# Altium schematic sheet Header_Conn.SchDoc
size A4
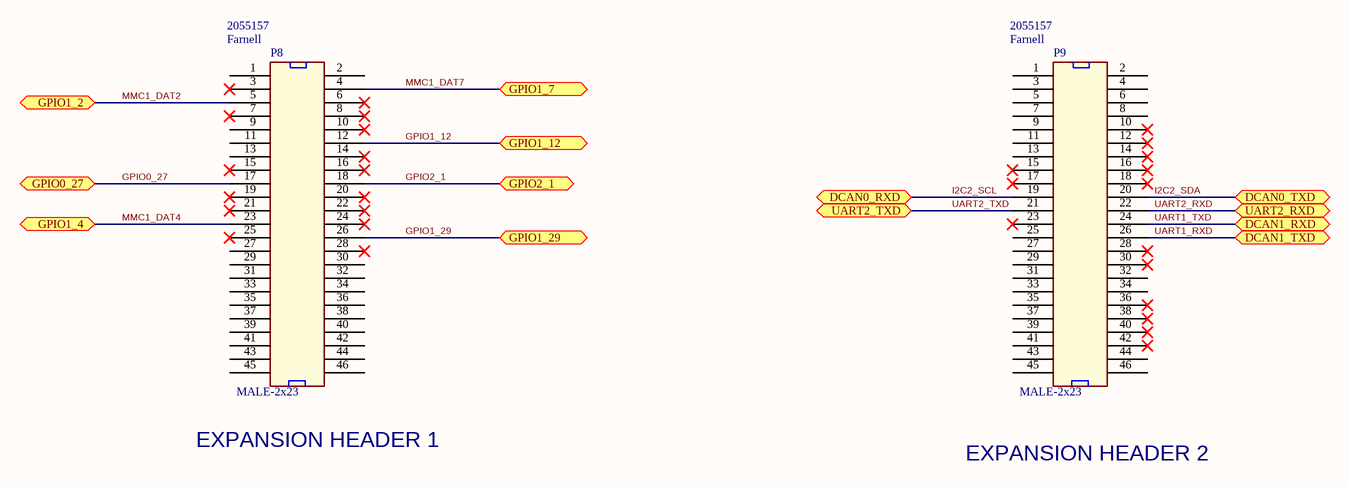
[diagram p0: Header_Conn.SchDoc]

## Parts
P8  MALE-2x23  Supplier 1: Farnell  Supplier Part Number 1: 2055157  [Beagle_Header]
P9  MALE-2x23  Supplier 1: Farnell  Supplier Part Number 1: 2055157  [Beagle_Header]

## Ports
DCAN0_RXD, DCAN0_TXD, DCAN1_RXD, DCAN1_TXD, GPIO0_27, GPIO1_2, GPIO1_4, GPIO1_7, GPIO1_12, GPIO1_29, GPIO2_1, UART2_RXD, UART2_TXD

## Nets
GPIO0_27: P8.17 ; port GPIO0_27
GPIO1_12: P8.12 ; port GPIO1_12
GPIO1_29: P8.26 ; port GPIO1_29
GPIO2_1: P8.18 ; port GPIO2_1
I2C2_SCL: P9.19 ; port DCAN0_RXD
I2C2_SDA: P9.20 ; port DCAN0_TXD
MMC1_DAT2: P8.5 ; port GPIO1_2
MMC1_DAT4: P8.23 ; port GPIO1_4
MMC1_DAT7: P8.4 ; port GPIO1_7
UART1_RXD: P9.26 ; port DCAN1_TXD
UART1_TXD: P9.24 ; port DCAN1_RXD
UART2_RXD: P9.22 ; port UART2_RXD
UART2_TXD: P9.21 ; port UART2_TXD

Not connected (* = marked no-connect by the designer): P8 1 2(26) 3(2)* 6(28)* 7(4)* 8(29)* 9(5) 10(30)* 11(6) 13(7) 14(32)* 15(8)* 16(33)* 19(10)* 20(35)* 21(11)* 22(36)* 24(37)* 25(13)* 27(14) 28(39)* 29(15) 30(40) 31(16) 32(41) 33(17) 34(42) 35(18) 36(43) 37(19) 38(44) 39(20) 40(45) 41(21) 42(46) 43(22) 44(47) 45(23) 46(48); P9 1 2(26) 3(2) 4(27) 5(3) 6(28) 7(4) 8(29) 9(5) 10(30)* 11(6) 12(31)* 13(7) 14(32)* 15(8)* 16(33)* 17(9)* 18(34)* 23(12)* 25(13) 27(14) 28(39)* 29(15) 30(40)* 31(16) 32(41) 33(17) 34(42) 35(18) 36(43)* 37(19) 38(44)* 39(20) 40(45)* 41(21) 42(46)* 43(22) 44(47) 45(23) 46(48)

## Notes on the sheet
- EXPANSION HEADER 1
- EXPANSION HEADER 2

## Library data of the parts
P8 P9 = BHead: MALE HEADER 2x23